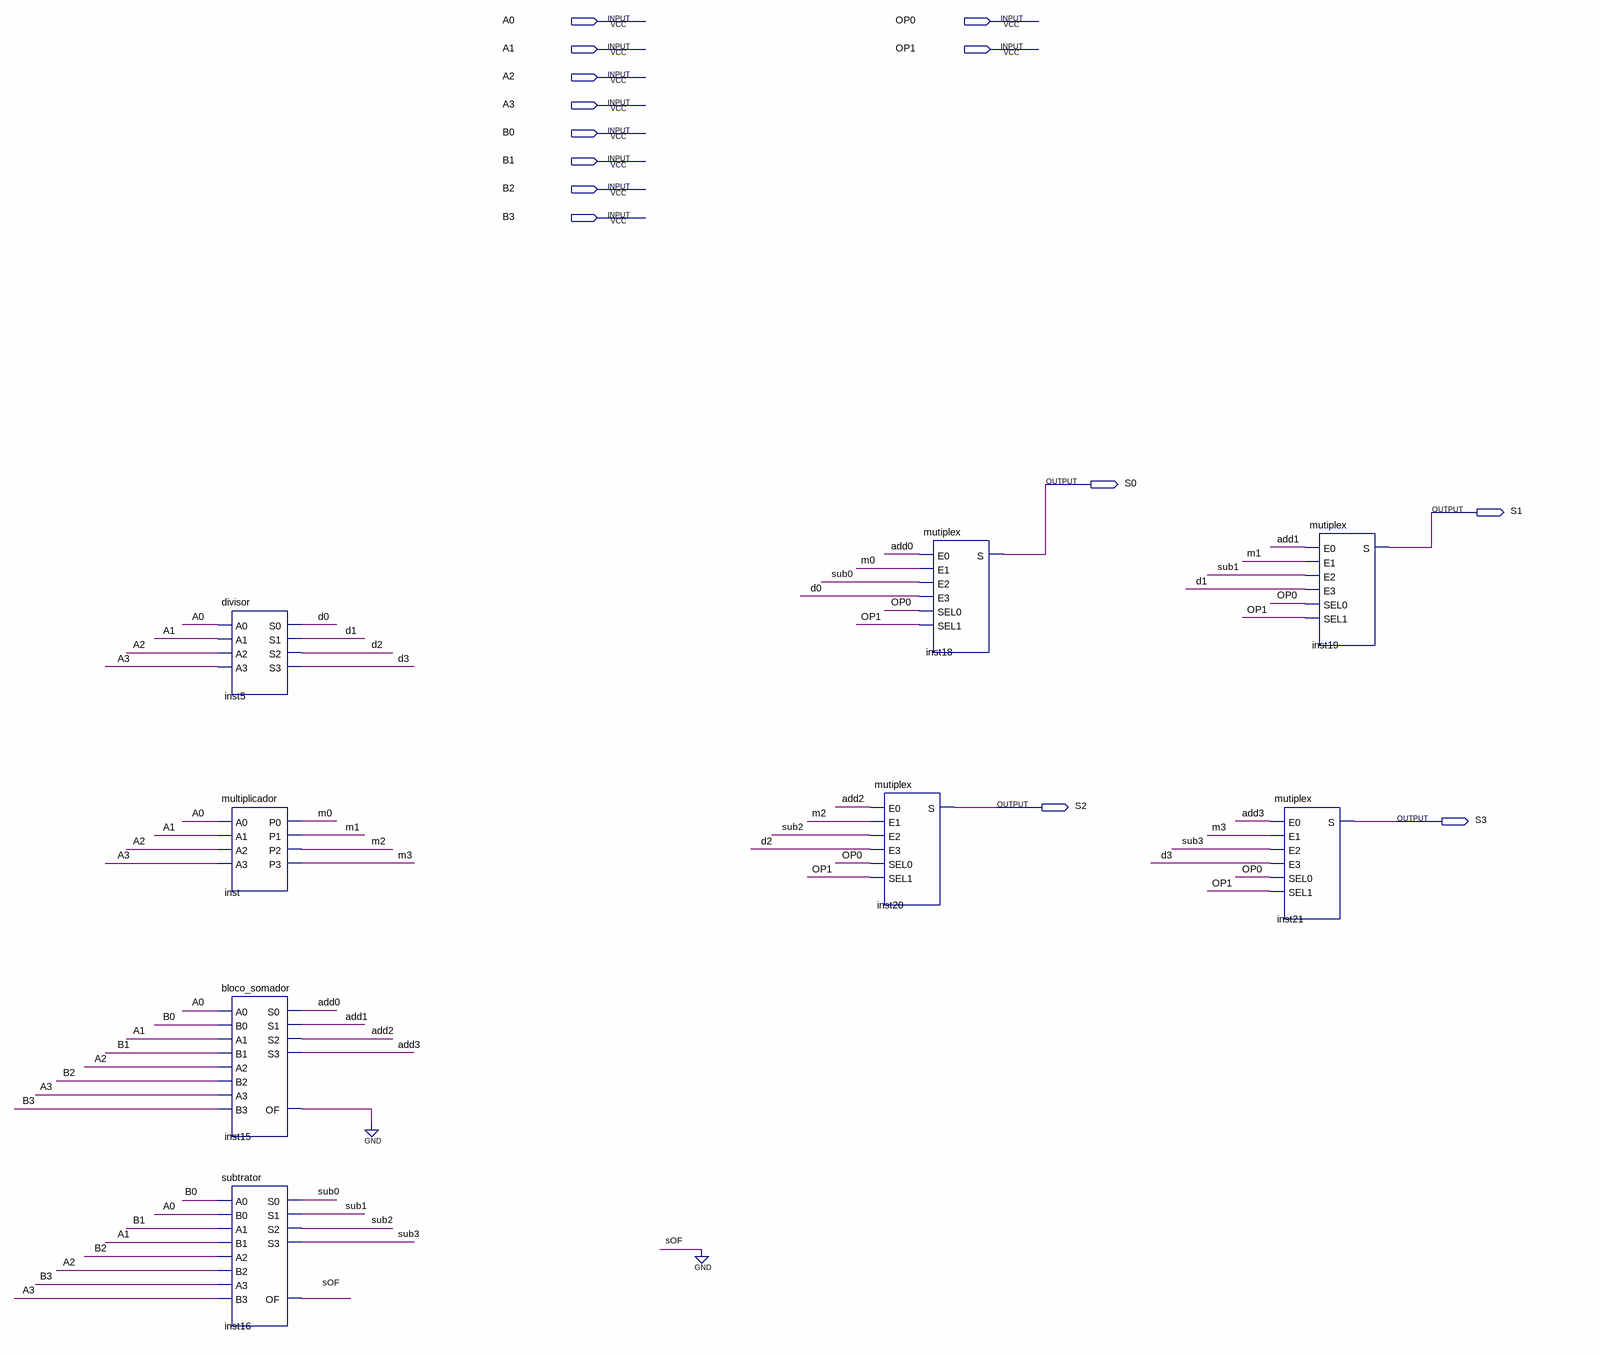
[diagram p0: schematic sheet]
// Quartus schematic calculadora.bdf as structural Verilog: 8 symbols, 14 pins
module calculadora (
  input  A0,
  input  OP0,
  input  A1,
  input  OP1,
  input  A2,
  input  A3,
  input  B0,
  input  B1,
  input  B2,
  input  B3,
  output S0,
  output S1,
  output S2,
  output S3
);

  wire add0, add1, add2, add3, d0, d1, d2, d3, inst15_of, m0, m1, m2, m3, sOF, sub0, sub1, sub2, sub3;

  divisor inst5 (.A0(A0), .A1(A1), .A2(A2), .A3(A3), .S0(d0), .S1(d1), .S2(d2), .S3(d3));
  multiplicador inst (.A0(A0), .A1(A1), .A2(A2), .A3(A3), .P0(m0), .P1(m1), .P2(m2), .P3(m3));
  bloco_somador inst15 (
    .A0(A0), .B0(B0), .A1(A1), .B1(B1), .A2(A2), .B2(B2), .A3(A3), .B3(B3), .S0(add0), .OF(inst15_of),
    .S1(add1), .S2(add2), .S3(add3));
  subtrator inst16 (
    .A0(B0), .B0(A0), .A1(B1), .B1(A1), .A2(B2), .B2(A2), .A3(B3), .B3(A3), .S0(sub0), .OF(sOF), .S1(sub1),
    .S2(sub2), .S3(sub3));
  mutiplex inst20 (.E0(add2), .E1(m2), .E2(sub2), .E3(d2), .SEL0(OP0), .SEL1(OP1), .S(S2));
  mutiplex inst18 (.E0(add0), .E1(m0), .E2(sub0), .E3(d0), .SEL0(OP0), .SEL1(OP1), .S(S0));
  mutiplex inst21 (.E0(add3), .E1(m3), .E2(sub3), .E3(d3), .SEL0(OP0), .SEL1(OP1), .S(S3));
  mutiplex inst19 (.E0(add1), .E1(m1), .E2(sub1), .E3(d1), .SEL0(OP0), .SEL1(OP1), .S(S1));
  // also tied to GND on the sheet: {inst15_of, sOF}
endmodule
